# EAGLE design LilyPad_Arduino_SimpleSnap (EAGLE 7.6.0)
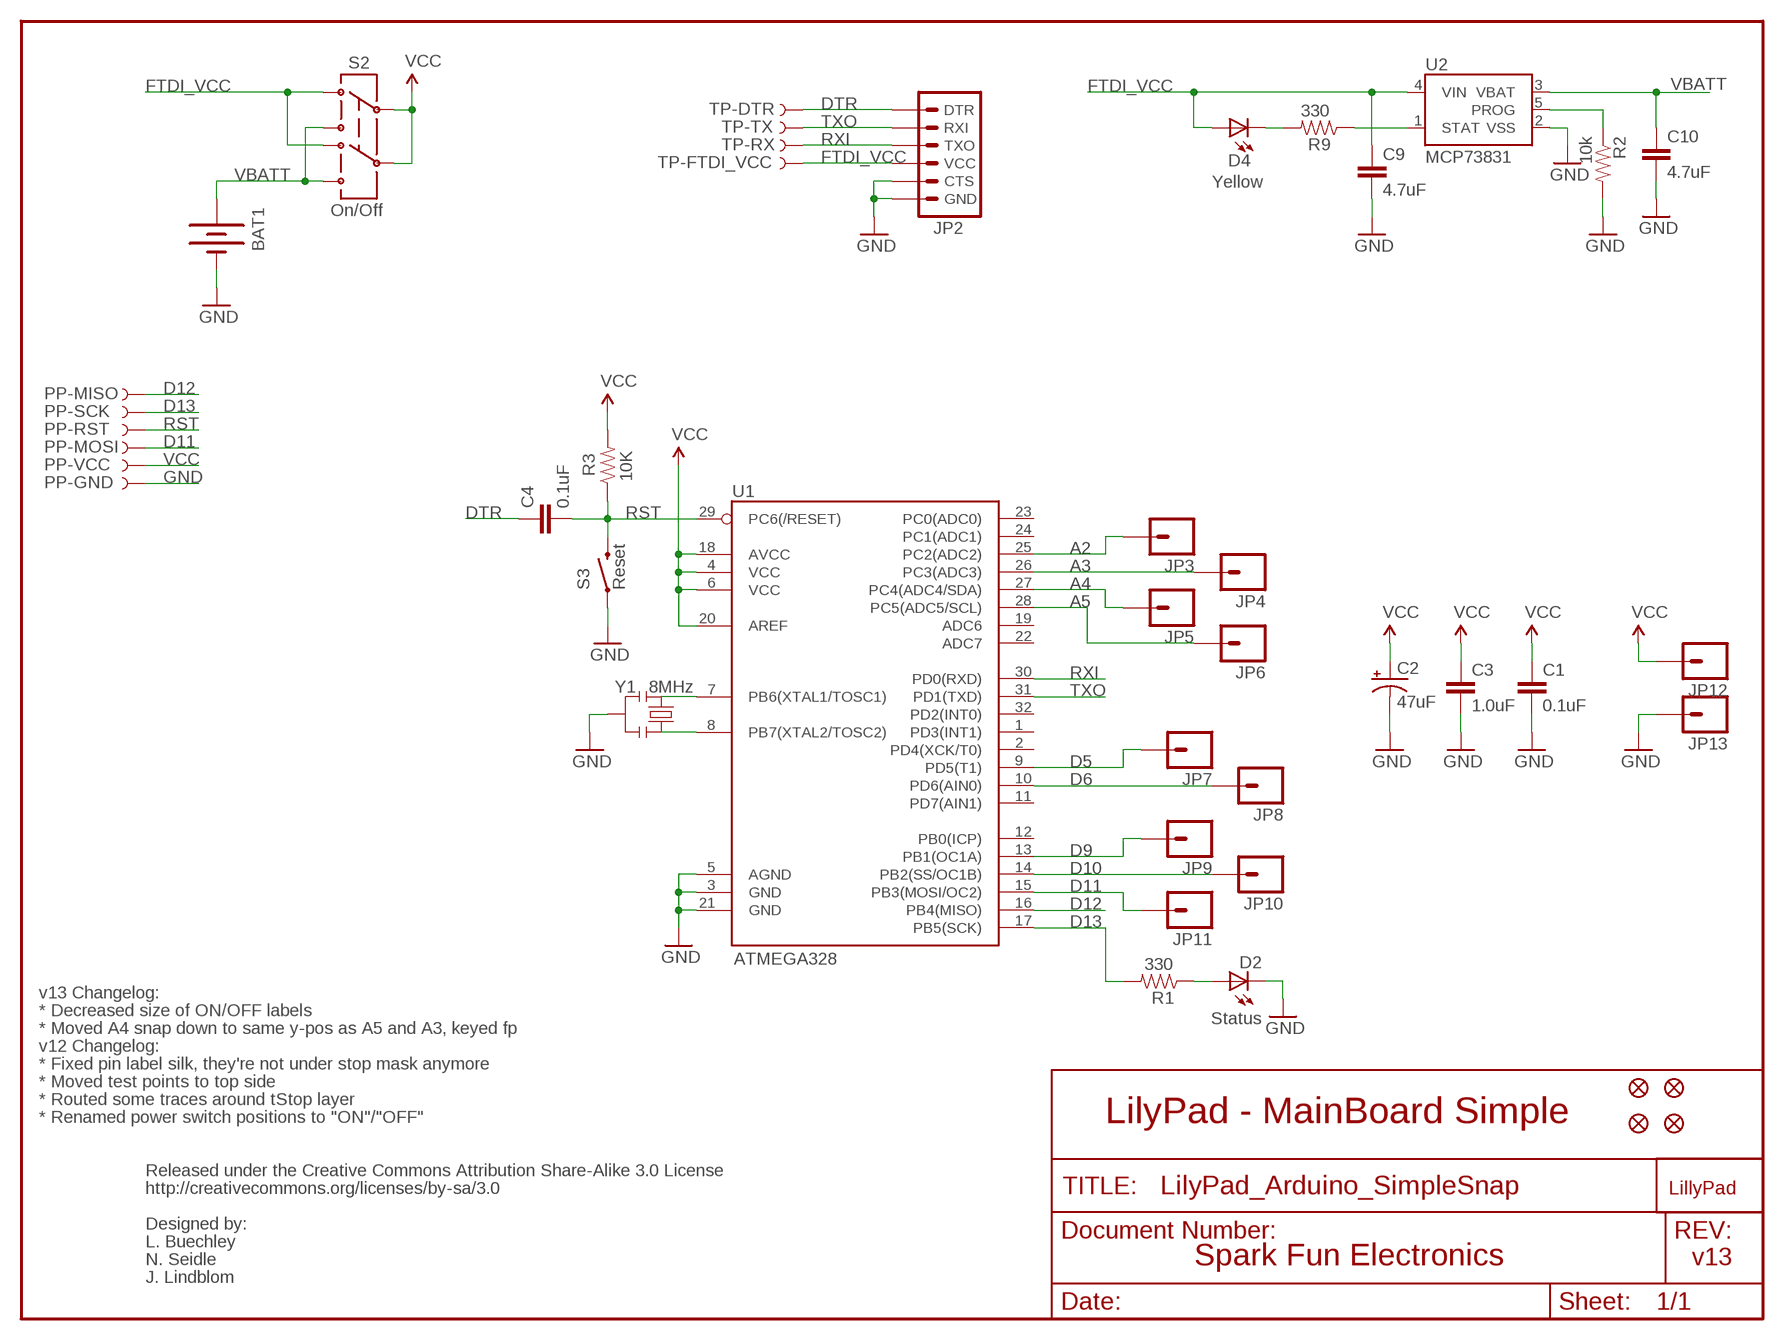
[diagram p0: schematic, sheet 1]

## Parts
BAT1  BATTERY110-TABS  [LIPO-110-TABS]
C1  0.1uF  CAP0402-CAP  [0402-CAP]
C2  47uF  CAP_POL3528  [EIA3528]
C3  1.0uF  CAP0402-CAP  [0402-CAP]
C4  0.1uF  CAP0402-CAP  [0402-CAP]
C9  4.7uF  CAP0402-CAP  [0402-CAP]
C10  4.7uF  CAP0402-CAP  [0402-CAP]
D2  Status  LED0603  [LED-0603]
D4  Yellow  LED0603  [LED-0603]
JP1  FIDUCIALUFIDUCIAL  [MICRO-FIDUCIAL]
JP2  ARDUINO_SERIAL_PROGRAMSMD  [1X06-SMD]
JP3  M01SNAP-FEMALE_LARGE  M01SNAP-FEMALE  [SNAP-FEMALE]
JP4  M01SNAP-FEMALE_LARGE  M01SNAP-FEMALE  [SNAP-FEMALE]
JP5  M01SNAP-FEMALE_LARGE  M01SNAP-FEMALE  [SNAP-FEMALE]
JP6  M01SNAP-FEMALE_LARGE  M01SNAP-FEMALE  [SNAP-FEMALE]
JP7  M01SNAP-FEMALE_LARGE  M01SNAP-FEMALE  [SNAP-FEMALE]
JP8  M01SNAP-FEMALE_LARGE  M01SNAP-FEMALE  [SNAP-FEMALE]
JP9  M01SNAP-FEMALE_LARGE  M01SNAP-FEMALE  [SNAP-FEMALE]
JP10  M01SNAP-FEMALE_LARGE  M01SNAP-FEMALE  [SNAP-FEMALE]
JP11  M01SNAP-FEMALE_LARGE  M01SNAP-FEMALE  [SNAP-FEMALE]
JP12  M01SNAP-FEMALE_LARGE  M01SNAP-FEMALE  [SNAP-FEMALE]
JP13  M01SNAP-FEMALE_LARGE  M01SNAP-FEMALE  [SNAP-FEMALE]
JP14  FIDUCIALUFIDUCIAL  [MICRO-FIDUCIAL]
JP15  FIDUCIALUFIDUCIAL  [MICRO-FIDUCIAL]
JP16  FIDUCIALUFIDUCIAL  [MICRO-FIDUCIAL]
PP-GND  TEST-POINT3X5  [PAD.03X.05]
PP-MISO  TEST-POINT3X5  [PAD.03X.05]
PP-MOSI  TEST-POINT3X5  [PAD.03X.05]
PP-RST  TEST-POINT3X5  [PAD.03X.05]
PP-SCK  TEST-POINT3X5  [PAD.03X.05]
PP-VCC  TEST-POINT3X5  [PAD.03X.05]
R1  330  RESISTOR0402-RES  [0402-RES]
R2  10k  RESISTOR0402-RES  [0402-RES]
R3  10K  RESISTOR0402-RES  [0402-RES]
R9  330  RESISTOR0402-RES  [0402-RES]
S2  On/Off  AYZ0202  [AYZ0202]
S3  Reset  SWITCH-MOMENTARY-2SMD  [TACTILE_SWITCH_SMD]
TP-DTR  TEST-POINT3X5  [PAD.03X.05]
TP-FTDI_VCC  TEST-POINT3X5  [PAD.03X.05]
TP-RX  TEST-POINT3X5  [PAD.03X.05]
TP-TX  TEST-POINT3X5  [PAD.03X.05]
U1  ATMEGA328  ATMEGA168  [TQFP32-08]
U2  MCP73831  [SOT23-5]
U$2  LOGO-LPLP  [LOGO-LILYPAD]
Y1  8MHz  RESONATORSMD  [RESONATOR-SMD]

## Nets
A2: JP3.1 U1.25(PC2(ADC2))
A3: JP4.1 U1.26(PC3(ADC3))
A4: JP5.1 U1.27(PC4(ADC4/SDA))
A5: JP6.1 U1.28(PC5(ADC5/SCL))
D5: JP7.1 U1.9(PD5(T1))
D6: JP8.1 U1.10(PD6(AIN0))
D9: JP9.1 U1.13(PB1(OC1A))
D10: JP10.1 U1.14(PB2(SS/OC1B))
D11: JP11.1 PP-MOSI.P$1 U1.15(PB3(MOSI/OC2))
D12: PP-MISO.P$1 U1.16(PB4(MISO))
D13: PP-SCK.P$1 R1.2 U1.17(PB5(SCK))
DTR: C4.1 JP2.1(DTR) TP-DTR.P$1
FTDI_VCC: C9.1 D4.A JP2.4(VCC) S2.3 S2.6 TP-FTDI_VCC.P$1 U2.4(VIN)
GND [VCC]: BAT1.- C1.2 C2.C(-) C3.2 C9.2 C10.2 D2.C JP2.5(CTS) JP2.6(GND) JP13.1 PP-GND.P$1 R2.2 S3.1 U1.3(GND) U1.5(AGND) U1.21(GND) U2.2(VSS) Y1.2
N$1: U1.7(PB6(XTAL1/TOSC1)) Y1.1
N$2: D2.A R1.1
N$3: U1.8(PB7(XTAL2/TOSC2)) Y1.3
N$8: D4.C R9.2
PROG: R2.1 U2.5(PROG)
RST: C4.2 PP-RST.P$1 R3.1 S3.3 U1.29(PC6(/RESET))
RXI: JP2.3(TXO) TP-RX.P$1 U1.30(PD0(RXD))
STAT: R9.1 U2.1(STAT)
TXO: JP2.2(RXI) TP-TX.P$1 U1.31(PD1(TXD))
VBATT: BAT1.+ C10.1 S2.1 S2.4 U2.3(VBAT)
VCC [VCC]: C1.1 C2.A(+) C3.1 JP12.1 PP-VCC.P$1 R3.2 S2.2 S2.5 U1.4(VCC) U1.6(VCC) U1.18(AVCC) U1.20(AREF)
Unconnected: U1.1(PD3(INT1)) U1.2(PD4(XCK/T0)) U1.11(PD7(AIN1)) U1.12(PB0(ICP)) U1.19(ADC6) U1.22(ADC7) U1.23(PC0(ADC0)) U1.24(PC1(ADC1)) U1.32(PD2(INT0))

## Notes on the sheet
- v13 Changelog:
- * Decreased size of ON/OFF labels
- * Moved A4 snap down to same y-pos as A5 and A3, keyed fp
- v12 Changelog:
- * Fixed pin label silk, they're not under stop mask anymore
- * Moved test points to top side
- * Routed some traces around tStop layer
- * Renamed power switch positions to "ON"/"OFF" | LilyPad - MainBoard Simple
- Released under the Creative Commons Attribution Share-Alike 3.0 License
- http://creativecommons.org/licenses/by-sa/3.0
- Designed by:
- L. Buechley
- N. Seidle | Spark Fun Electronics | v13
- J. Lindblom

## Library data of the parts
BAT1 = SparkFun:BATTERY: Battery Holders Various common sizes : AA, AAA, 20mm coin cell and 12mm coin cell.
C1 C3 C4 C9 C10 = SparkFun:CAP: Capacitor Standard 0603 ceramic capacitor, and 0.1" leaded capacitor.
C2 = SparkFun:CAP_POL: Capacitor Polarized These are standard SMD and PTH capacitors. Normally 10uF, 47uF, and 100uF in electrolytic and tantalum varieties. Always verify the external diameter of the through hole cap, it varies with capacity, voltage, and manufacturer. The EIA devices should be standard.
D2 D4 = SparkFun:LED: LEDs Standard schematic elements and footprints for 5mm, 3mm, 1206, and 0603 sized LEDs. 5mm - Spark Fun Electronics SKU : COM-00529 (and others)
JP1 JP14-JP16 = SparkFun:FIDUCIAL: Fiducial Alignment Points Various fiducial points for machine vision alignment.
JP2 = SparkFun:ARDUINO_SERIAL_PROGRAM
JP3-JP13 = SparkFun:M01: Header 1 Standard 1-pin 0.1" header. Use with straight break away headers (SKU : PRT-00116), right angle break away headers (PRT-00553), swiss pins (PRT-00743), machine pins (PRT-00117), and female headers (PRT-00115).
PP-GND PP-MISO PP-MOSI PP-RST PP-SCK PP-VCC TP-DTR TP-FTDI_VCC TP-RX TP-TX = SparkFun:TEST-POINT
R1-R3 R9 = SparkFun:RESISTOR: Resistor Basic schematic elements and footprints for 0603, 1206, and PTH resistors.
S2 = SparkFun:AYZ0202: SPDT Slide Switch Simple SMD single-pull double-throw slide switch. Good for less than 350mA power switch, switching UARTs between devices, etc. Spark Fun Electronics SKU : COM-00597
S3 = SparkFun:SWITCH-MOMENTARY-2
U1 = SparkFun:ATMEGA168
U2 = SparkFun:MCP73831: Microchip's MCP73831 Miniature single cell, fully integrated Li-Ion, Li-polymer charge management controller http://ww1.microchip.com/downloads/en/DeviceDoc/21984a.pdf
U$2 = LilyPad-Wearables:LOGO-LP
Y1 = SparkFun:RESONATOR: Resonator Small SMD resonator. This is the itty bitty 10/20MHz resonators with built in caps. CSTCE10M0G55 and CSTCE20M0V53. Footprint has been reviewed closely but hasn't been tested yet.

## Net classes
0 Default: width 0.203 mm
1 VCC: width 0.254 mm

## Board
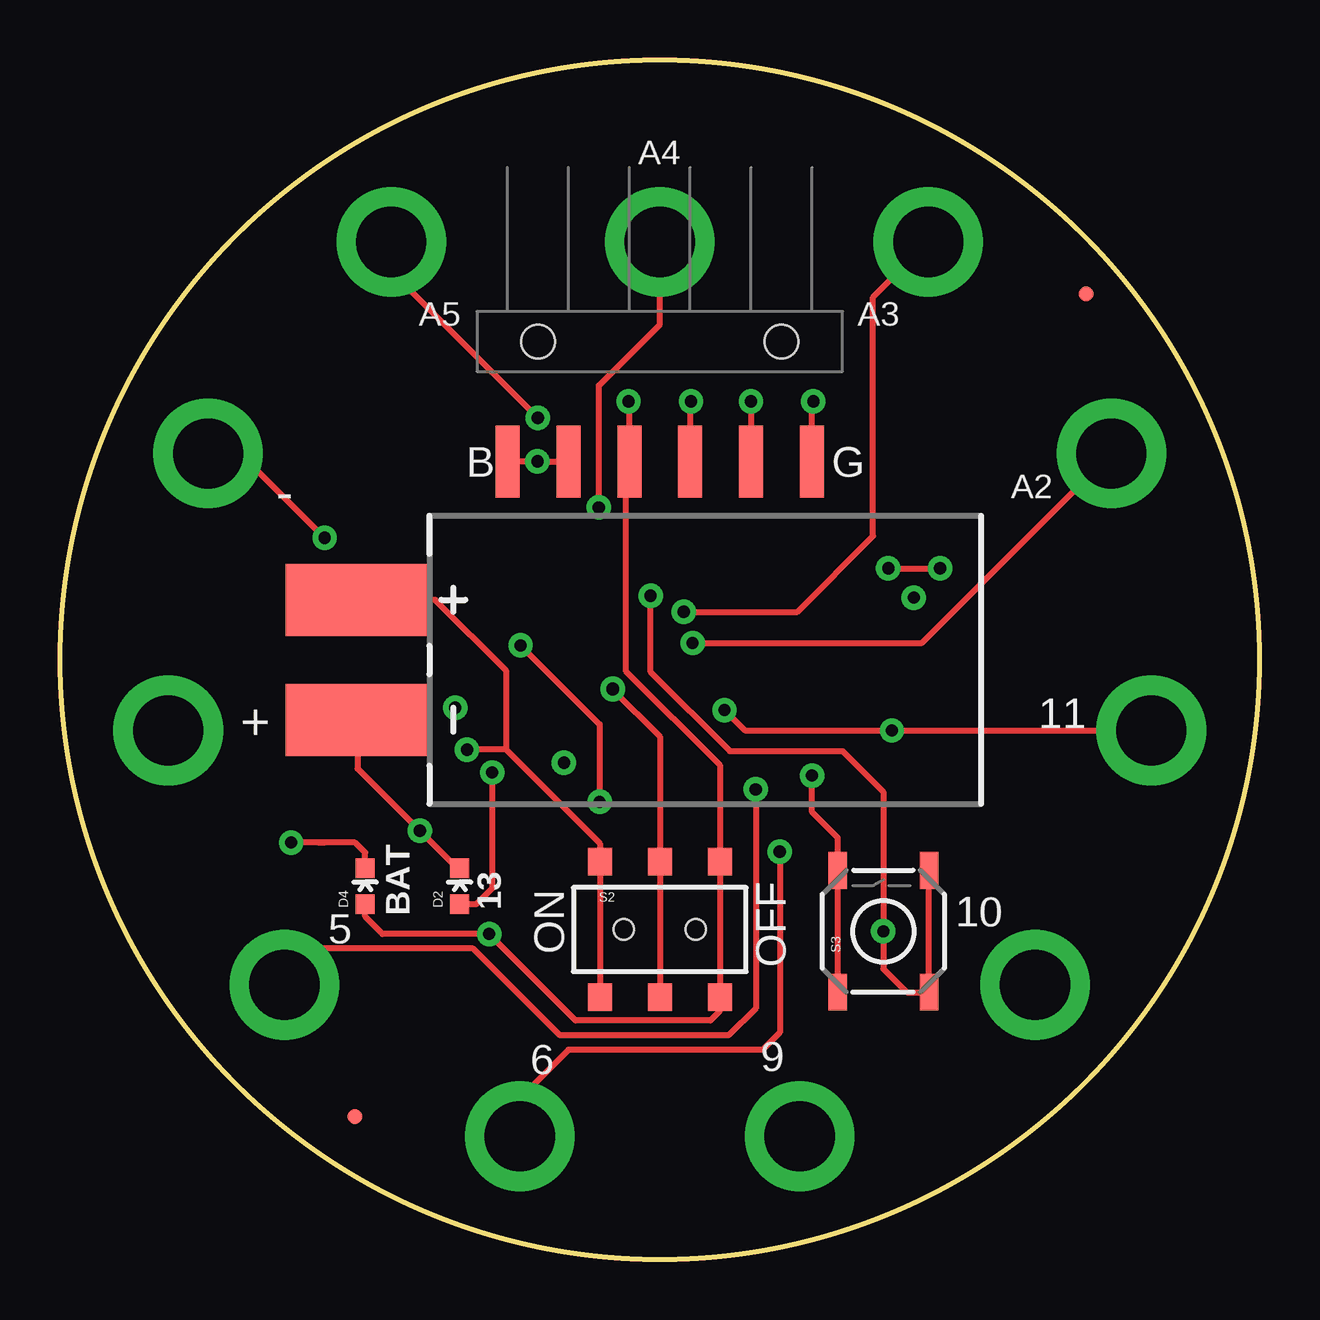
[diagram p1: board, top side]
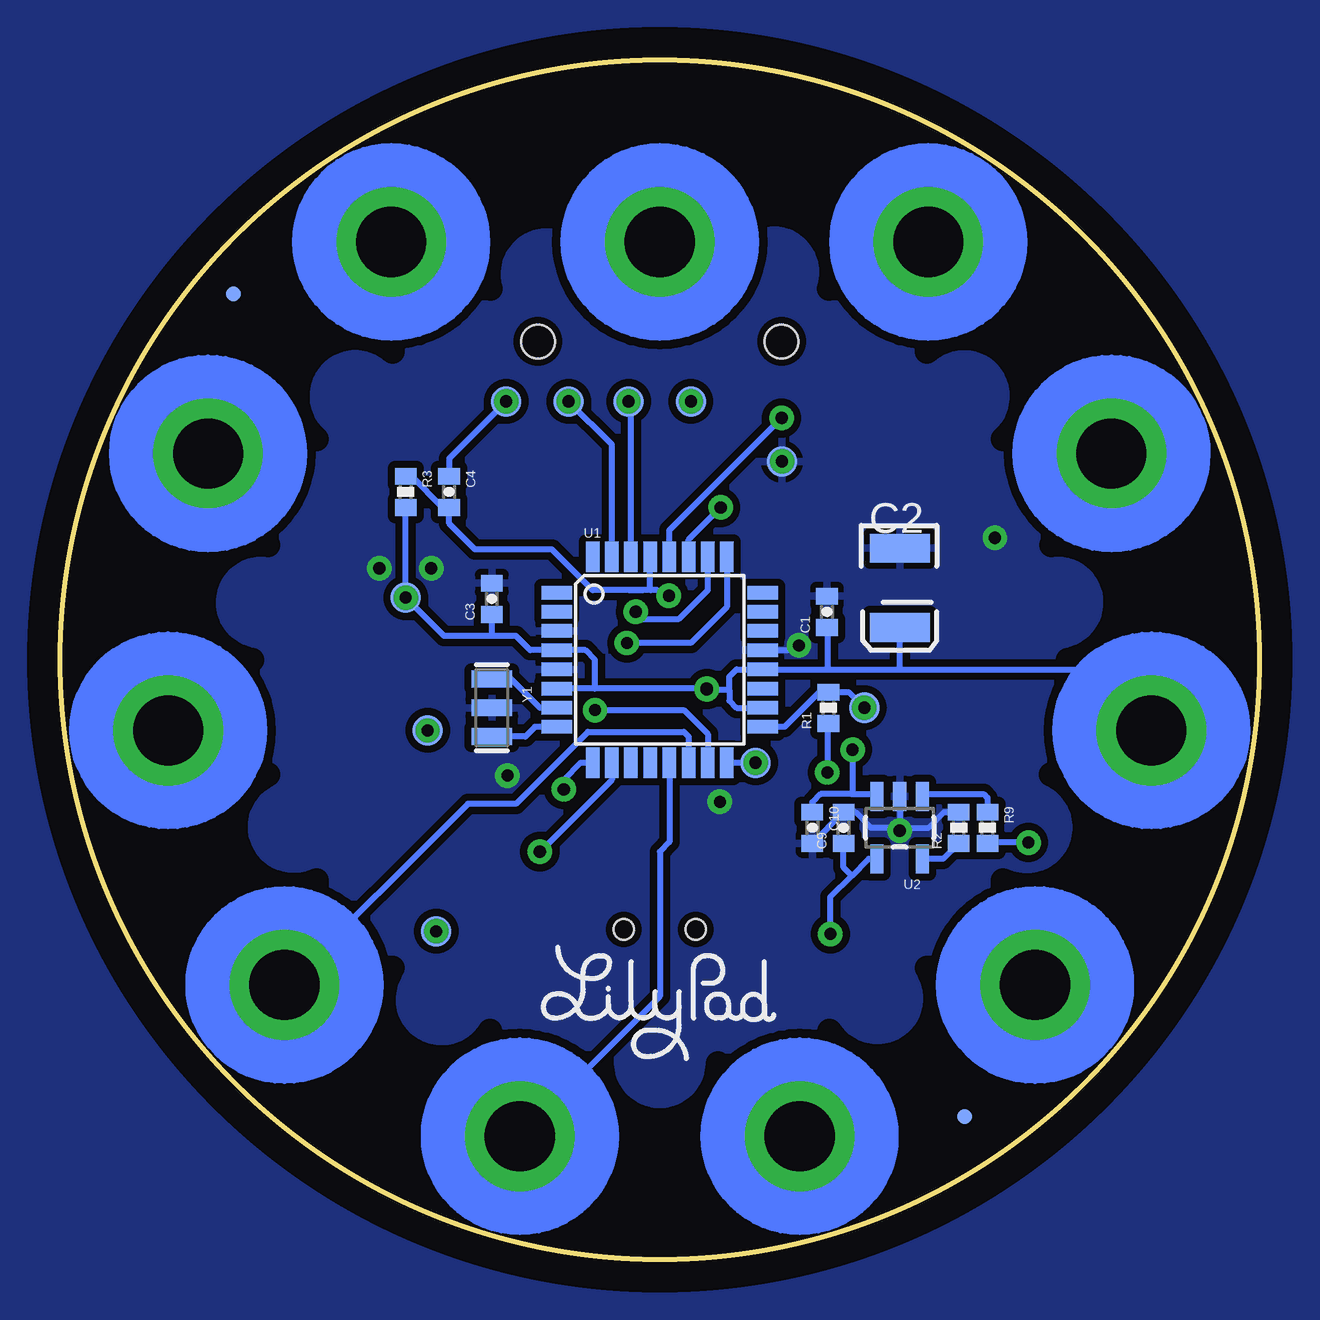
[diagram p2: board, bottom side, seen from below]

Size 50 x 50 mm. Coordinates in mm from the lower left corner, seen from the top.
Outline: circle at 25,25 radius 25
Copper layers (1*16): Top 0.035mm / dielectric 1.5mm / Bottom 0.035mm
Design rules "default": minimum track width 8mil, minimum drill 20mil, track to track 8mil, track to pad 8mil, pad to pad 8mil, via to via 8mil, smd to smd 8mil, copper to edge 8mil, drill to drill 8mil, minimum pad ring 12mil, minimum via ring 10mil, stop-mask expansion 4mil, vias tented up to drill 20mil, thermal gap 10mil
bRestrict: area 2.4,2.4 to 47.6,47.6; area 21,42.8 to 23.5,44; area 31.6,41.3 to 34.4,43; area 36.3,38.4 to 38.9,40.7; area 40,34.1 to 42,36.9; area 42.2,29.2 to 43.6,31.8; area 42.8,23.9 to 44,26.2; area 42.2,18.2 to 43.7,20.9; area 36.3,9.4 to 39,11.7; area 31.7,7 to 34.5,8.7; area 26.5,6 to 28.9,7.3; area 21.1,6 to 23.6,7.3; area 15.6,7 to 18.3,8.7; area 11,9.3 to 13.8,11.6; area 8,13.1 to 10.1,15.9; area 6.4,18.2 to 8,20.8; area 6,23.7 to 7.2,26.2; area 6.3,29.1 to 7.9,31.7; area 8,34 to 10.1,36.9; area 11,38.3 to 13.7,40.6; area 15.4,41.2 to 18.4,43; area 26.4,42.5 to 29.1,44; area 40,13 to 42,16.1; 22 lines

### Footprints (pad centres in the part's own frame; a part is rotated, then mirrored left to right if it is on the bottom)
LIPO-110-TABS = smd 3 x 6: + 2.5,14.5; - -2.5,14.5
0402-CAP = smd 0.7 x 0.9: 1 -0.65,0; 2 0.65,0
EIA3528 = smd 1.2 x 2.5: A 1.65,0; C -1.65,0
LED-0603 = smd 0.8 x 0.8: A 0,-0.75; C 0,0.75
MICRO-FIDUCIAL = smd 0.635 x 0.635: 1 0,0
1X06-SMD = smd 1 x 3: 1 -6.35,5; 2 -3.81,5; 3 -1.27,5; 4 1.27,5; 5 3.81,5; 6 6.35,5 | hole 1.4: -5.08,0; 5.08,0
SNAP-FEMALE = drill 2.921 pad 4.572: 1 0,0
PAD.03X.05 = smd 1.27 x 1.27: P$1 0,0
0402-RES = smd 0.7 x 0.9: 1 -0.65,0; 2 0.65,0
AYZ0202 = smd 1 x 1.15: 1 -2.5,2.825; 2 0,2.825; 3 2.5,2.825; 4 -2.5,-2.825; 5 0,-2.825; 6 2.5,-2.825 | hole 0.85: 1.5,0; -1.5,0
TACTILE_SWITCH_SMD = smd 1.524 x 0.762: 1 -2.54,1.905; 2 2.54,1.905; 3 -2.54,-1.905; 4 2.54,-1.905
TQFP32-08 = smd 1.27 x 0.559: 1 -4.293,2.8; 2 -4.293,2; 3 -4.293,1.2; 4 -4.293,0.4; 5 -4.293,-0.4; 6 -4.293,-1.2; 7 -4.293,-2; 8 -4.293,-2.8; 17 4.293,-2.8; 18 4.293,-2; 19 4.293,-1.2; 20 4.293,-0.4; 21 4.293,0.4; 22 4.293,1.2; 23 4.293,2; 24 4.293,2.8 | smd 0.559 x 1.27: 9 -2.8,-4.293; 10 -2,-4.293; 11 -1.2,-4.293; 12 -0.4,-4.293; 13 0.4,-4.293; 14 1.2,-4.293; 15 2,-4.293; 16 2.8,-4.293; 25 2.8,4.293; 26 2,4.293; 27 1.2,4.293; 28 0.4,4.293; 29 -0.4,4.293; 30 -1.2,4.293; 31 -2,4.293; 32 -2.8,4.293
SOT23-5 = smd 0.55 x 1.2: 1 -0.95,-1.3; 2 0,-1.3; 3 0.95,-1.3; 4 0.95,1.3; 5 -0.95,1.3
RESONATOR-SMD = smd 0.7 x 1.7: 1 -1.2,0; 2 0,0; 3 1.2,0

### Placement (x,y rotation side)
BAT1  26.91,25 90 top
C1  18.03,27 90 bottom
C2  15,28 270 bottom
C3  32,27.54 90 bottom
C4  33.78,32 270 bottom
C9  17.34,18 90 bottom
C10  18.64,18 270 bottom
D2  16.66,15.56 0 top
D4  12.72,15.56 0 top
JP1  42.78,40.24 0 top
JP2  25,38.27 180 top
JP3  43.83,33.6 0 bottom
JP4  36.19,42.41 0 bottom
JP5  25,42.41 0 bottom
JP6  13.81,42.41 0 bottom
JP7  9.36,11.44 0 bottom
JP8  19.17,5.14 0 bottom
JP9  30.83,5.14 0 bottom
JP10  40.64,11.44 0 bottom
JP11  45.49,22.05 0 bottom
JP12  4.51,22.05 0 bottom
JP13  6.17,33.6 0 bottom
JP14  12.3,5.95 0 top
JP15  12.3,5.95 0 bottom
JP16  42.78,40.24 0 bottom
PP-GND  19.9,33.27 0 bottom
PP-MISO  21.01,20.71 180 bottom
PP-MOSI  34.68,22.05 0 bottom
PP-RST  34.32,13.68 0 bottom
PP-SCK  16.47,23 180 bottom
PP-VCC  35.59,27.59 0 bottom
R1  17.97,23 90 bottom
R2  12.54,18 90 bottom
R3  35.59,32 270 bottom
R9  11.34,18 270 bottom
S2  25,13.76 0 top
S3  34.32,13.68 90 top
TP-DTR  31.4,35.77 0 bottom
TP-FTDI_VCC  23.7,35.77 0 bottom
TP-RX  26.3,35.77 0 bottom
TP-TX  28.8,35.77 90 bottom
U1  25,25 0 bottom
U2  15,18 180 bottom
U$2  25,11.03 0 bottom
Y1  32,23 270 bottom

### Tracks (layer width: path | path; a pad name or v marks a point on that pad's centre or on a via)
A2  (via drill 0.51)
  Top 0.254: JP3.1 35.93,25.7 v26.37,25.7
  Bottom 0.254: v26.37,25.7 23.7,25.7 22.2,27.2 U1.25
A3  (via drill 0.51)
  Top 0.254: v26,27 30.73,27 33.89,30.16 33.89,40.11 JP4.1
  Bottom 0.254: U1.26 23,27.9 24.2,26.7 25.7,26.7 v26,27
A4  (via drill 0.51)
  Top 0.254: v22.46,31.35 22.46,36.43 25,38.97 JP5.1
  Bottom 0.254: U1.27 23.8,30.01 v22.46,31.35
A5  (via drill 0.51)
  Top 0.254: v19.92,35.08 13.81,41.19 JP6.1
  Bottom 0.254: U1.28 24.6,30.4 v19.92,35.08
D5  (via drill 0.51)
  Top 0.254: v29,19.6 29,10.48 27.87,9.35 20.84,9.35 17.23,12.96 10.87,12.96 JP7.1
  Bottom 0.254: U1.9 28.29,20.71 29,20 v29,19.6
D6  (via drill 0.51)
  Top 0.254: v30,17 30,9.46 29.28,8.74 21.19,8.74 19.17,6.72 JP8.1
  Bottom 0.254: U1.10 27,20 v30,17
D9
  Bottom 0.254: U1.13 24.6,17.4 25,17 25,10.97 JP9.1
D10
  Bottom 0.254: U1.14 23.8,21.8 24,22 28,22 31,19 33,19 40.56,11.44 JP10.1
D11  (via drill 0.51)
  Top 0.254: v27.7,22.9 28.55,22.05 PP-MOSI.P$1 JP11.1
  Bottom 0.254: U1.15 23,21.9 24,22.9 v27.7,22.9
  other vias: 34.68,22.05
D12  (via drill 0.51)
  Bottom 0.254: PP-MISO.P$1 U1.16
  other vias: 21.01,20.71
D13  (via drill 0.51)
  Bottom 0.254: U1.17 19.8,22.2 18.35,23.65 R1.2 17.12,23.65 PP-SCK.P$1
  other vias: 16.47,23
DTR  (via drill 0.51)
  Top 0.254: JP2.1 31.35,35.72 TP-DTR.P$1
  Bottom 0.254: C4.1 33.78,33.39 TP-DTR.P$1
  other vias: 31.4,35.77
FTDI_VCC  (via drill 0.51)
  Top 0.254: 23.73,33 JP2.4 | 23.73,33 23.6,32.87 23.6,24.51 27.5,20.61 S2.3 S2.6 27.5,10.36 27.11,9.97 21.49,9.97 v17.89,13.57 13.44,13.57 12.72,14.29 D4.A | 23.73,33 23.73,35.74 TP-FTDI_VCC.P$1
  Bottom 0.254: U2.4 16.3,16.7 17,16 | C9.1 17.34,16.34 17,16 | v17.89,13.57 17.89,15.11 17,16
  other vias: 23.7,35.77
GND  (via drill 0.51)
  Top 0.254: JP2.6 PP-GND.P$1 JP2.5 | v34.52,28.81 v36.68,28.81 | v31.35,20.17 31.35,18.65 32.41,17.59 S3.1 | D2.C 16.56,16.31 v15,17.87 12.4,20.47 BAT1.- | JP13.1 7.51,33.6 v11.03,30.08 | v22.49,19.08 22.49,22.31 v19.2,25.6
  Bottom 0.254: R2.2 13.15,18.65 13.8,18 14.97,18 | C10.2 C9.2 16.85,18.65 16.2,18 14.97,18 | v19.2,25.6 19.4,25.4 U1.21 | U2.2 15,18.03 14.97,18
  other vias: 19.9,33.27
  pour Bottom (isolate 0.305): -3.54,53.54 53.54,53.54 53.54,-3.54 -3.54,-3.54
N$1
  Bottom 0.254: U1.7 30,23 31.2,24.2 Y1.1
N$2  (via drill 0.51)
  Top 0.254: D2.A 17.35,14.81 18.02,15.47 v18.02,20.3
  Bottom 0.254: v18.02,20.3 18.02,22.3 R1.1
N$3
  Bottom 0.254: U1.8 30.2,22.2 30.6,21.8 Y1.3
N$8  (via drill 0.51)
  Top 0.254: 10.78,17.38 v9.63,17.38 | 10.78,17.38 11.03,17.38 | D4.C 12.72,16.96 12.3,17.38 10.78,17.38
  Bottom 0.254: v9.63,17.38 11.31,17.38 R9.2
PROG
  Bottom 0.254: R2.1 13.19,16.7 U2.5
RST  (via drill 0.51)
  Top 0.254: v24.62,27.67 24.62,24.49 27.92,21.19 32.62,21.19 34.32,19.49 PP-RST.P$1 34.32,12.12 35.3,11.14 S3.3 36.23,16.29
  Bottom 0.254: R3.1 35.35,32.65 34.05,31.35 C4.2 33.78,30.68 32.7,29.6 29.5,29.6 27.8,27.9 26.27,27.9 | 26.27,27.9 25.7,27.9 | v24.62,27.67 24.87,27.67 25.1,27.9 25.38,27.9 | 25.38,27.9 26.27,27.9 | U1.29 25.4,27.92 25.38,27.9
  other vias: 34.32,13.68
RXI  (via drill 0.51)
  Top 0.254: JP2.3 26.27,35.74 TP-RX.P$1
  Bottom 0.254: U1.30 26.2,35.67 TP-RX.P$1
  other vias: 26.3,35.77
STAT
  Bottom 0.254: R9.1 11.34,19.24 11.5,19.4 13.95,19.4 U2.1
TXO  (via drill 0.51)
  Top 0.254: JP2.2 TP-TX.P$1
  Bottom 0.254: U1.31 27,33.97 TP-TX.P$1
  other vias: 28.8,35.77
VBATT  (via drill 0.51)
  Top 0.254: S2.4 S2.1 22.5,17.34 18.59,21.25 | 18.59,21.25 18.59,24.56 15.64,27.5 BAT1.+ | 18.59,21.25 v16.97,21.25
  Bottom 0.254: C10.1 18.64,19.06 18.3,19.4 17,19.4 | 17,19.4 16.05,19.4 U2.3 | v16.97,21.25 16.97,19.43 17,19.4
VCC  (via drill 0.51)
  Top 0.254: S2.5 S2.2 25,21.8 v23.04,23.76 v23.04,23.8
  Bottom 0.254: 18,24.6 U1.20 21.8,24.6 22.1,24.3 22.1,23.73 | 18,24.6 15,24.6 | 15,24.6 C2.A | C1.1 18,26.32 18,24.6 | 22.1,23.73 22.1,23.3 21.8,23 U1.18 | 27.7,23.8 U1.6 | 27.7,23.8 27.7,25 28.1,25.4 U1.4 30.4,25.4 31,26 32,26 | R3.2 PP-VCC.P$1 34,26 32,26 | 32,26 C3.1 | v23.04,23.8 27.7,23.8 | v23.04,23.76 22.13,23.76 22.1,23.73 | 15,24.6 7.06,24.6 JP12.1
  other vias: 35.59,27.59

### Text on the board
tPlace: A4 | A5 | A3 | B | G | A2 | - | + | 11 | 13 | BAT | 10 | 5 | ON | OFF | 6 | 9